# Altium schematic sheet CAN.SchDoc
size A3
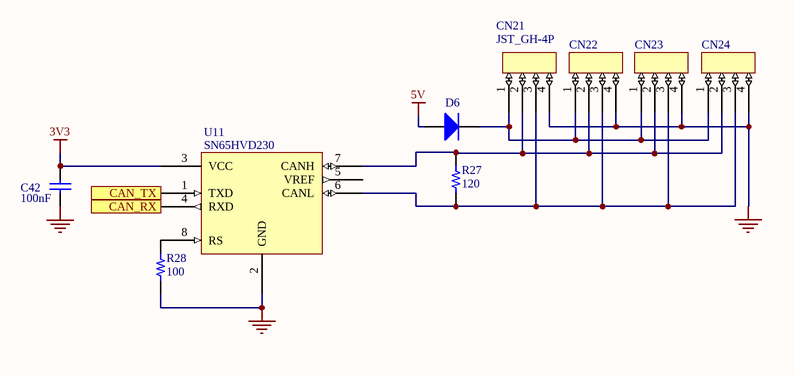
[diagram p0: CAN.SchDoc]

## Parts
C42  value 100nF  [0402]  (hidden comment: Cap)
CN21  JST_GH-4P  [JST_GH-4P]
CN22  JST_GH-4P  [JST_GH-4P]  (value not drawn)
CN23  JST_GH-4P  [JST_GH-4P]  (value not drawn)
CN24  JST_GH-4P  [JST_GH-4P]  (value not drawn)
D6  SS12F  [SMAF_DIODE]  (value not drawn)
R27  120  [2010_SMD_Resistor]
R28  100  [0805 - duplicate]
U11  SN65HVD230  [SOIC8-TI_CAN]

## Ports
CAN_RX, CAN_TX

## Nets
3V3: C42.2 U11.3(VCC)
5V: D6.1(A)
GND: C42.1 CN21.4 CN22.4 CN23.4 CN24.4 R28.1 U11.2(GND)
CAN_RX: U11.4(RXD) ; port CAN_RX
CAN_TX: U11.1(TXD) ; port CAN_TX
NetCN21_1: CN21.1 CN22.1 CN23.1 CN24.1 D6.2(K)
NetCN21_2: CN21.2 CN22.2 CN23.2 CN24.2 R27.2 U11.7(CANH)
NetCN21_3: CN21.3 CN22.3 CN23.3 CN24.3 R27.1 U11.6(CANL)
NetR28_2: R28.2 U11.8(RS)

Not connected (* = marked no-connect by the designer): U11 5(VREF)

## Library data of the parts
R27 R28 = Resistor
U11 = SN65HVD230: CAN Transceiver
C42 = Cap: Published: 8-Jun-2000; LatestRevisionDate: 17-Jul-2002; LatestRevisionNote: Re-released for DXP Platform.; PackageReference: RAD-0.3; Publisher: Altium Limited; PackageDescription: Radial Cap, Thru-Hole; 2 Leads; 0.3 in Pin Spacing